# Altium schematic sheet Oscillator.SchDoc
size A3; Organization: Altium Limited; Address1: L3, 12a Rodborough Rd; Address2: Frenchs Forest; Address3: NSW; Address4: Australia 2086; SheetNumber: 4; SheetTotal: 4
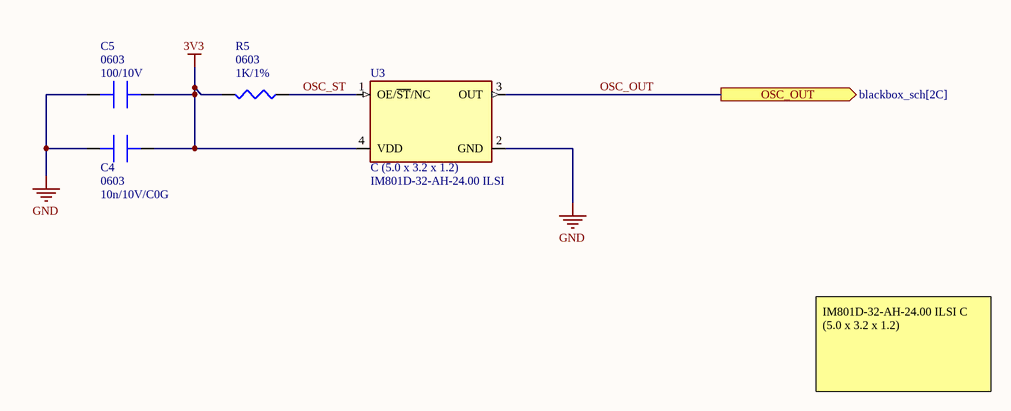
[diagram p0: Oscillator.SchDoc]

## Parts
C4  value 10n/10V/C0G  Package: 0603  [CAPC1608X10L [0603]]  (hidden comment: C)
C5  value 100/10V  Package: 0603  [CAPC1608X10L [0603]]  (hidden comment: C)
R5  value 1K/1%  Package: 0603  [RESC1608X05L [0603]]  (hidden comment: R)
U3  Package: C (5.0 x 3.2 x 1.2)  PN: IM801D-32-AH-24.00 ILSI  [IM801C]  (hidden comment: IM801x-xx-xx-xx.xxx)

## Ports
OSC_OUT (out, see blackbox_sch[2C])

## Nets
3V3: C4.2 C5.2 R5.1 U3.4(VDD)
GND: C4.1 C5.1 U3.2(GND)
OSC_OUT: U3.3(OUT) ; port OSC_OUT
OSC_ST: R5.2 U3.1(OE/~{ST}/NC)

## Notes on the sheet
- IM801D-32-AH-24.00 ILSI C (5.0 x 3.2 x 1.2)
- TITLE:
- PROJECT:
- FILE NAME:
- DRAWN BY:
- CHECKED BY:
- DATE:
- SHEET NO.:
- PROJ. REV.:
- OF
- SHEET REV.:
- SIZE:
- A3

## Library data of the parts
C4 C5 = C: Standard capacitor
R5 = R: Standard resistor
U3 = IM801x-xx-xx-xx.xxx: MEMS oscillator, low power, LVCMOS; HelpURL: https://www.tme.eu/Document/af49f0dca67518895ecb09acc4553fdf/IM801_Series_16_A.pdf